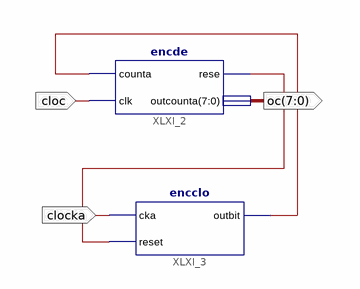
[diagram p0: schematic sheet 1]
// Xilinx ISE schematic myenc.sch (spartan6) as structural Verilog: 2 symbols, 3 ports
module myenc (
  input  cloc,
  input  clocka,
  output [7:0] oc
);

  wire XLXN_1, XLXN_2;

  encde XLXI_2 (.counta(XLXN_2), .clk(cloc), .rese(XLXN_1), .outcounta(oc));
  encclo XLXI_3 (.cka(clocka), .reset(XLXN_1), .outbit(XLXN_2));
endmodule
